# Altium project Adafruit SCD-41.PrjPcb
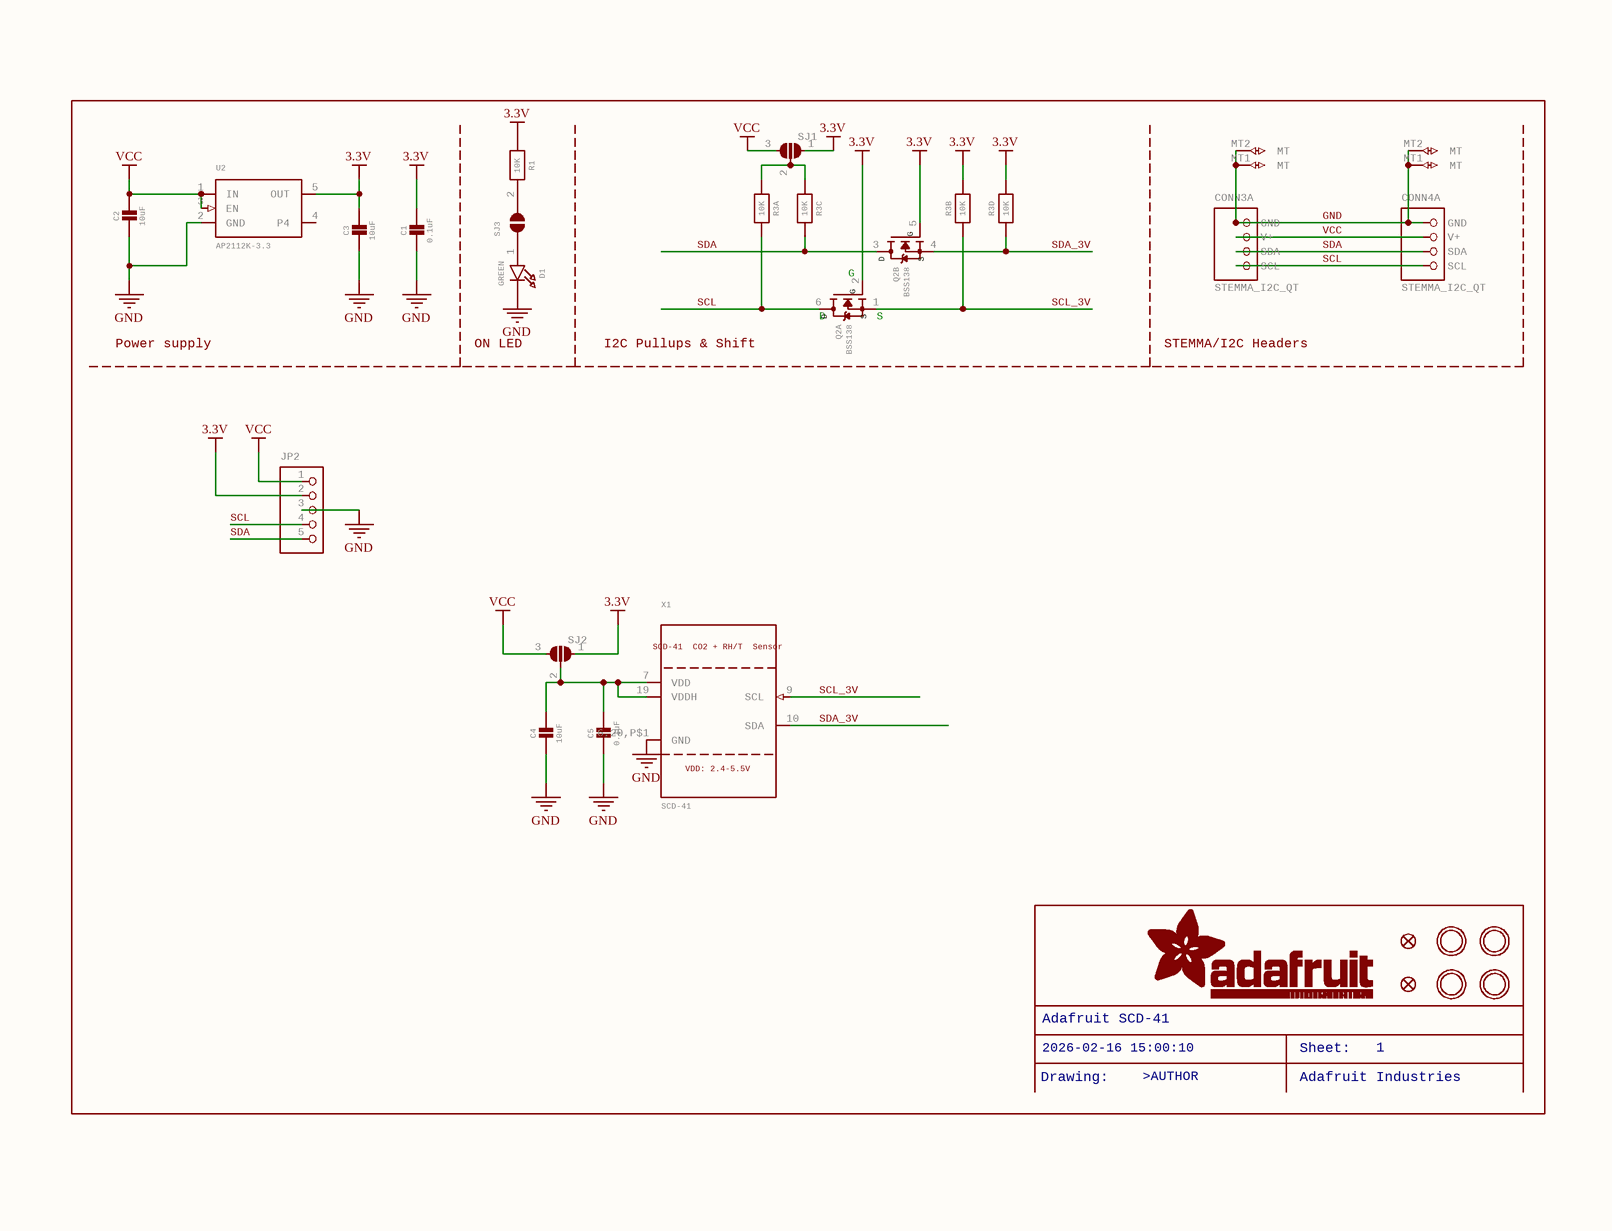
[diagram p0: Adafruit SCD-41.SchDoc]
1 sheet, 23 parts. Net scope: global (net labels, ports and power ports of the same name join across sheets).
Board file: Adafruit SCD-41.PcbDoc

## Sheet Adafruit SCD-41.SchDoc: Adafruit SCD-41
size 282 x 215 mm; COMPANY: ADAFRUIT INDUSTRIES; DRAWN: KTOWN; REV: A; Origin: Eagle; OriginPath: C:\Users\cleme\OneDrive - Université Laval\UL\Session H2026_8\PFE\Layout\Adafruit SCD41\Adafruit SCD-41.sch; OriginSheet: 1; Date: 2026-02-16 15:00:10; SheetNumber: 1; Author: >AUTHOR; GateName_1: G$1; SymbolName_1: FRAME_A4_ADAFRUIT; LibraryName: microbuilder; DeviceSetName: FRAME_A4_ADAFRUIT; Sheet: Sheet:; AdafruitIndustries: Adafruit Industries; Drawing: Drawing:

### Parts
C1  0.1uF  [0603-NO]
C2  10uF  [0805-NO]
C3  10uF  [0805-NO]
C4  10uF  [0805-NO]
C5  0.1uF  [0603-NO]
CONN3  STEMMA_I2C_QT  [JST_SH4]  (parts A,B,C of 3)
CONN4  STEMMA_I2C_QT  [JST_SH4]  (parts A,B,C of 3)
D1  GREEN  [CHIPLED_0603_NOOUTLINE]
FID3  FIDUCIAL_1MM  [FIDUCIAL_1MM]  (value not drawn)
FID4  FIDUCIAL_1MM  [FIDUCIAL_1MM]  (value not drawn)
JP2  HEADER-1X576MIL  [1X05_ROUND_76]  (value not drawn)
Q2  BSS138  [SOT363]  (parts A,B of 2)
R1  10K  [0603-NO]
R3  10K  [RESPACK_4X0603]  (parts A,B,C,D of 4)
SJ1  SOLDERJUMPER_2WAY  [SOLDERJUMPER_2WAY_OPEN_NOPASTE]  (value not drawn)
SJ2  SOLDERJUMPER_2WAY  [SOLDERJUMPER_2WAY_OPEN_NOPASTE]  (value not drawn)
SJ3  SOLDERJUMPERCLOSED  [SOLDERJUMPER_CLOSEDWIRE]  (value not drawn)
U2  AP2112K-3.3  [SOT23-5]
U$1  MOUNTINGHOLE3.0THIN  [MOUNTINGHOLE_3.0_PLATEDTHIN]  (value not drawn)
U$17  MOUNTINGHOLE3.0THIN  [MOUNTINGHOLE_3.0_PLATEDTHIN]  (value not drawn)
U$19  MOUNTINGHOLE3.0THIN  [MOUNTINGHOLE_3.0_PLATEDTHIN]  (value not drawn)
U$21  MOUNTINGHOLE3.0THIN  [MOUNTINGHOLE_3.0_PLATEDTHIN]  (value not drawn)
X1  SCD-41  SCD-41
CO2+RH/T
Sensor: SCD-41 / CO2 + RH/T / Sensor  VDD:2.4-5.5V: VDD: 2.4-5.5V  [SCD41]

### Nets
3.3V: C1.1 C3.1 JP2.2 Q2.2(G) Q2.5(G) R1.1 R3.2 R3.4 SJ1.1 SJ2.1 U2.5(OUT)
GND: C1.2 C2.2 C3.2 C4.2 C5.2 CONN3.1(GND) CONN3.MT1(MT) CONN3.MT2(MT) CONN4.1(GND) CONN4.MT1(MT) CONN4.MT2(MT) D1.C JP2.3 U2.2(GND) X1.6,20,P$1(GND)
VCC: C2.1 CONN3.2(V+) CONN4.2(V+) JP2.1 SJ1.3 SJ2.3 U2.1(IN) U2.3(EN)
SCL: CONN3.4(SCL) CONN4.4(SCL) JP2.4 Q2.6(D) R3.8
SCL_3V: Q2.1(S) R3.7 X1.9(SCL)
SDA: CONN3.3(SDA) CONN4.3(SDA) JP2.5 Q2.3(D) R3.6
SDA_3V: Q2.4(S) R3.5 X1.10(SDA)
NetC4_1: C4.1 C5.1 SJ2.2 X1.7(VDD) X1.19(VDDH)
NetD1_A: D1.A SJ3.1
NetR1_2: R1.2 SJ3.2
NetR3_1: R3.1 R3.3 SJ1.2

Not connected (* = marked no-connect by the designer): U2 4(P4)

### Notes on the sheet
- (near Q2) D
- (near Q2) G
- (near Q2) S
- Power supply
- ON LED
- I2C Pullups & Shift
- STEMMA/I2C Headers
- Adafruit SCD-41
- Drawing:
- 2026-02-16 15:00:10
- >AUTHOR
- Sheet:
- Adafruit Industries
- 1

### Library data of the parts
C1 C5 = CAP_CERAMIC0603_NO: Ceramic Capacitors   For new designs, use the packages preceded by an '_' character since they are more reliable:   The following footprints should be used on most boards: _0402 - Standard footprint for regular board layouts  _0603 - Standard footprint for regular board layouts  _0805 - Standard footprint for regular board layouts  _1206 - Standard footprint for regular board layouts       For extremely tight-pitch boards where space is at a premium, the following 'micro-pitch' footprints can be used (smaller pads, no silkscreen outline, etc.): _0402MP - Micro-pitch footprint for very dense/compact boards  _0603MP - Micro-pitch footprint for very dense/compact boards  _0805MP - Micro-pitch footprint for very dense/compact boards  _1206MP - Micro-pitch footprint for very dense/compact boards; GateName_1: G$1; SymbolName_1: CAPACITOR; DeviceName: 0603_NO; LibraryName: microbuilder; DeviceSetName: CAP_CERAMIC
C2-C4 = CAP_CERAMIC0805-NOOUTLINE: Ceramic Capacitors   For new designs, use the packages preceded by an '_' character since they are more reliable:   The following footprints should be used on most boards: _0402 - Standard footprint for regular board layouts  _0603 - Standard footprint for regular board layouts  _0805 - Standard footprint for regular board layouts  _1206 - Standard footprint for regular board layouts       For extremely tight-pitch boards where space is at a premium, the following 'micro-pitch' footprints can be used (smaller pads, no silkscreen outline, etc.): _0402MP - Micro-pitch footprint for very dense/compact boards  _0603MP - Micro-pitch footprint for very dense/compact boards  _0805MP - Micro-pitch footprint for very dense/compact boards  _1206MP - Micro-pitch footprint for very dense/compact boards; GateName_1: G$1; SymbolName_1: CAPACITOR; DeviceName: 0805-NOOUTLINE; LibraryName: microbuilder; DeviceSetName: CAP_CERAMIC
CONN3 CONN4 = STEMMA_I2C_QT: GateName_1: G$1; GateName_2: G$2; SymbolName_2: MOUNTING; GateName_3: G$3; DeviceName: _QT; SymbolName_1: STEMMA_I2C; SymbolName_3: MOUNTING; LibraryName: microbuilder; DeviceSetName: STEMMA_I2C
D1 = LED0603_NOOUTLINE: LED0603 - 0603 Surface Mount Package    2mA: Green LED - Low Power (3.9mcd, 2ma, 1.7Vf) - Digikey: 475-2709-2-ND  Orange LED - Low Power (9.8mcd, 2ma, 1.8Vf) - Digikey: 475-1194-2-ND  Red LED - Low Power (5mcd, 2ma, 1.8Vf) - Digikey: 475-1195-2-ND  Yellow LED - Low Power (7mcd, 2ma, 1.8Vf) - Digikey: 475-1196-2-ND       5mA: Blue LED - Low Power (17mcd, 5ma, 2.9Vf) - Digikey: LNJ937W8CRACT-ND    0805 - 0805 Surface Mount Package    2mA: Red LED (8.8mcd, 2mA, 1.8Vf, Clear) - Low Power [Digikey: 475-2510-1-ND]  Green LED (5mcd, 2mA, 1.8Vf, Clear) - Low Power [Digikey: 475-2730-1-ND]  Yellow LED (11.3mcd, 2mA, 1.8Vf, Clear) - Low Power [Digikey: 475-2555-1-ND]       20mA: Red LED (104mcd, 20mA, Diffused) - LS R976 [Digikey: 475-1278-6-ND]  Red LED (12mcd, 20mA, 2.0Vf, Clear) - APT2012EC [Digikey: 754-1128-1-ND]  Green LED (15mcd, 20mA, 2.2Vf, Clear) - APT2012GC [Digikey: 754-1131-1-ND]  Orange LED (160mcd, 20mA, 2.1Vf, Clear) - APT2012SECK [Digikey: 754-1130-1-ND]     1206 - 1206 Surface Mount Package  Green LED (26mcd, 20mA, Diffused) - LG N971  [Digikey: 475-1407-6-ND]  Red LED (15mcd, 20mA, Diffused) - LH N974 [Digikey: 475-1416-6-ND]     Cree - Cree High-Power Surface Mount LEDs  XPEBWT-L1-0000-00D50 - White 111lm 350mA 2.9Vf 6200K 110Â°  XTEAWT-00-0000-00000LEE3 - White 114lm 350mA 2.85Vf 5000K 115Â°     Everlight - Everlight 45-21 Series Surface Mount LEDs  45-21/QK2C-B2832AC2CB2/2T - Warm White 2000mcd 20mA 3.25Vf 3050K 120Â°  45-21/LK2C-B38452C4CB2/2T - Nuetral White 2000mcd 20mA 3.25Vf 4150K 120Â°  45-21/LK2C-B50634C6CB2/2T - Cold White 2200mcd 20mA 3.25Vf 5650K 120Â°     PLCC2 Reverse Mount LS T77K-J1L2-1-0-2-R18-Z - Red 11.25mcd 2mA 1.8Vf 630nm 120Â°  LO T77K-L1M2-24-Z - Orange 19.6mcd 2mA 1.8Vf 606nm 120Â°  LY T77K-K2M1-26-Z - Yellow 15.7mcd 2mA 1.8Vf 587nm 120Â°; GateName_1: G$1; SymbolName_1: LED; DeviceName: 0603_NOOUTLINE; LibraryName: microbuilder; DeviceSetName: LED
FID3 FID4 = FIDUCIAL_1MM: Fiducial Alignment Points   Various fiducial points for machine vision alignment.; GateName_1: G$1; DeviceName: _1MM; BOM: EXCLUDE; SymbolName_1: FIDUCIAL; LibraryName: microbuilder; DeviceSetName: FIDUCIAL
JP2 = HEADER-1X576MIL: PIN HEADER; GateName_1: A; SymbolName_1: PINHD5; DeviceName: 76MIL; LibraryName: microbuilder; DeviceSetName: HEADER-1X5
Q2 = MOSFET-N_DUAL: Dual N-Channel MOSFET   SOT363 (2.0x1.25mm) 2N7002PS - 60V, 320mA [Digikey: 568-5984-1-ND]; GateName_1: 1; GateName_2: 2; SymbolName_1: MOSFET-N; SymbolName_2: MOSFET-N; LibraryName: microbuilder; DeviceSetName: MOSFET-N_DUAL; D: D; S: S; G: G
R1 = RESISTOR_0603_NOOUT: Resistors   For new designs, use the packages preceded by an '_' character since they are more reliable:   The following footprints should be used on most boards: _0402 - Standard footprint for regular board layouts  _0603 - Standard footprint for regular board layouts  _0805 - Standard footprint for regular board layouts  _1206 - Standard footprint for regular board layouts       For extremely tight-pitch boards where space is at a premium, the following 'micro-pitch' footprints can be used (smaller pads, no silkscreen outline, etc.): _0402MP - Micro-pitch footprint for very dense/compact boards  _0603MP - Micro-pitch footprint for very dense/compact boards  _0805MP - Micro-pitch footprint for very dense/compact boards  _1206MP - Micro-pitch footprint for very dense/compact boards; GateName_1: G$1; SymbolName_1: RESISTOR; DeviceName: _0603_NOOUT; LibraryName: microbuilder; DeviceSetName: RESISTOR
R3 = RESISTOR_4PACK: Resistor Packs (4 resistors)   4 x 0603 10K 1/16W - Digikey: YC164J-10KCT-ND; GateName_1: G$1; GateName_2: G$2; GateName_3: G$3; GateName_4: G$4; SymbolName_1: RESISTOR; SymbolName_2: RESISTOR; SymbolName_3: RESISTOR; SymbolName_4: RESISTOR; LibraryName: microbuilder; DeviceSetName: RESISTOR_4PACK
SJ1 SJ2 = SOLDERJUMPER_2WAY: 2-Way Solder Jumper; GateName_1: G$1; SymbolName_1: SOLDERJUMPER_2WAY; LibraryName: microbuilder; DeviceSetName: SOLDERJUMPER_2WAY
SJ3 = SOLDERJUMPERCLOSED: SMD Solder JUMPER   Solder the two pads together to create a connection, or remove the solder to break it.REFLOW - Use this footprint for solder paste and reflow ovens. WAVE - Use this footprint for hand-soldering (larger pads).    CLOSED - Has a trace between the two pads to ensure it is closed by default.  The trace needs to be cut to disable the jumper, and can be closed again by creating a solder bridge between the two pads.; GateName_1: 1; SymbolName_1: SOLDERJUMPER; DeviceName: CLOSED; LibraryName: microbuilder; DeviceSetName: SOLDERJUMPER
U2 = VREG_SOT23-5: SOT23-5 Fixed Voltage Regulators      Part	Current Out	V Out	V In	V Dropout	Î¸JA (Â°C/W)	TJ (Â°C)	Digikey Part No.	     ADP121	  150mA	  3.3V	  3.4-5.5V	  0.09V @ 150mA	  --	  --	  ADP121-AUJZ33R7CT-ND	     ADP121	  150mA	  3.0V	  3.1-5.5V	  0.09V @ 150mA	  --	  --	  ADP121-AUJZ30R7CT-ND	     ADP122	  300mA	  3.3V	  3.4-5.5V	  0.085V @ 300mA	  --	  --	  ADP122AUJZ-3.3-R7CT-ND	     ADP1712	  300mA	  3.3V	  3.5-5.5V	  0.17V @ 300mA	  --	  --	  ADP1712AUJZ-3.3-R7TR-ND	     AP7311 (Low Cost)	  150mA	  3.3V	  3.5-6V	  0.15V @ 150mA	  --	  --	  AP7311-33WG-7DICT-ND	     LD39015M18R	  150mA	  1.8V	  1.9V-5.5V	  0.08V @ 100mA	  --	  --	  497-6977-1-ND	     LP2985A-33DBVR	  150mA	  3.3V	  3.3-16V	  0.28V @ 150mA	  206	  150	  296-18479-1-ND	     MCP1824T-3302E/OT	  300mA	  3.3V	  3.5V-6V	  0.2V @ 300mA	  --	  --	  MCP1824T-3302E/OTCT-ND	     MIC5205-2.5YM5 TR	  150mA	  2.5V	  2.7-16V	  0.165V @ 150mA	  --	  --	  576-1257-2-ND	     MIC5205-3.0YM5 TR	  150mA	  3.0V	  3.2V-16V	  0.165V @ 150mA	  --	  --	  576-1258-2-ND	     MIC5205-3.3YM5 TR	  150mA	  3.3V	  3.5V-16V	  0.165V @ 150mA	  --	  --	  576-1259-2-ND	     TPS780330220	  150mA	  3.3V+2.2V	  3.6-5.5V	  250mV Max	  --	  --	  296-23332-1-ND	     TDA3663/N1,135	  100mA	  3.3V	  3.5-45V	  0.18V @ 50mA	  --	  --	  568-5343-1-ND	     	  	  	  	  	  	  	  	     	  	  	  	  	  	  	  	   Max operating temp can be calculated using Î¸JA, TJ (max junction temperature), and power in watts.  Set the "Maximum Ambient Temperature" until it reaches TJ ("Max Junction Temperature"), which is the absolute limit for safe use of the regulator: Heat Sink Temperature Calculator   For example, With 12V source into a 3.3V LP2985 and a 30mA load, we are dissipating (12V-3.3V) * 0.03A = 0.261W.  With a Î¸JA of 206 Â°C/W, a TJ of 150Â°C, and 261mW we can safely use the chip without a heat sink up to 75Â°C (=147.1Â°C Junction Temperature).; GateName_1: G$1; SymbolName_1: VREG_SOT23-5; LibraryName: adafruit_power; DeviceSetName: VREG_SOT23-5
U$1 U$17 U$19 U$21 = MOUNTINGHOLE3.0THIN: Mounting Hole   For #2 screws (0.086"/2.18mm width, 0.094"/2.4mm hole) use 2.5mm; GateName_1: G$1; BOM: EXCLUDE; SymbolName_1: MOUNTINGHOLE; DeviceName: 3.0THIN; LibraryName: adafruit_electromech; DeviceSetName: MOUNTINGHOLE
X1 = SCD-41: GateName_1: G$1; SymbolName_1: SCD41; LibraryName: adafruit_sensor; DeviceSetName: SCD-41